# Altium schematic sheet ESP32.SchDoc
size A4
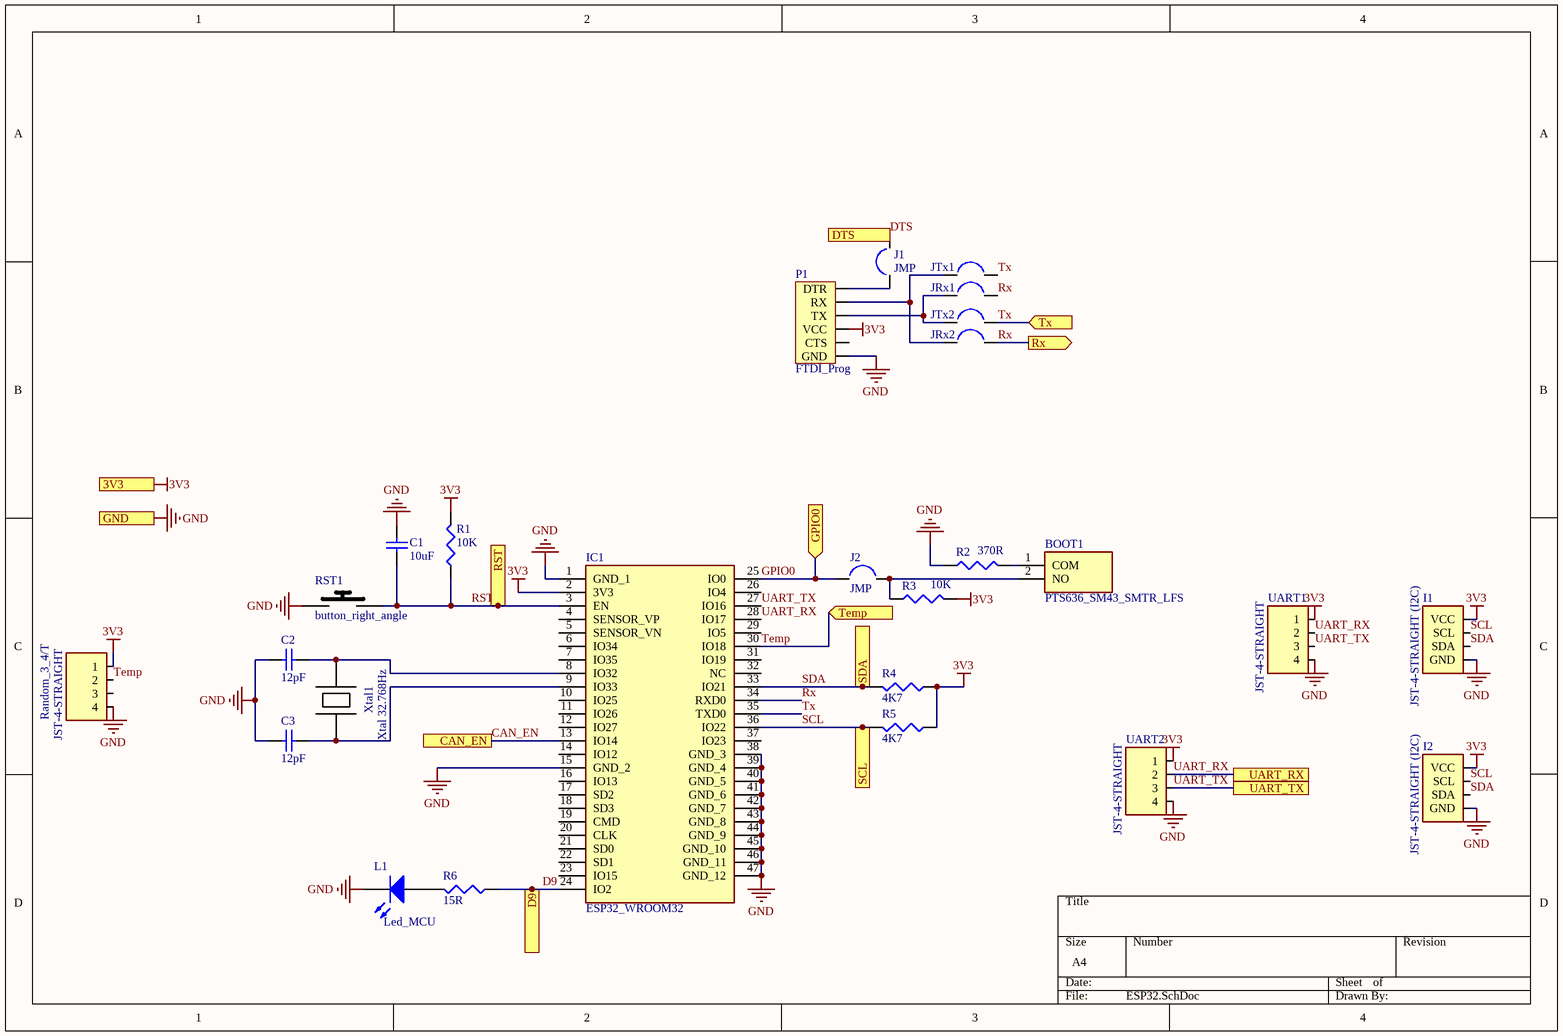
[diagram p0: ESP32.SchDoc]

## Parts
BOOT1  PTS636_SM43_SMTR_LFS  [PTS636SM43SMTRLFS]
C1  10uF  [1608[0603]]
C2  12pF  [1608[0603]]
C3  12pF  [1608[0603]]
I1  JST-4-STRAIGHT (I2C)  [JST-4-STRAIGHT]
I2  JST-4-STRAIGHT (I2C)  [JST-4-STRAIGHT]
IC1  ESP32_WROOM32  [ESP32WROOM32]
J1  JMP  [Jumper]
J2  JMP  [Jumper]
JRx1  JMP  [Jumper]  (value not drawn)
JRx2  JMP  [Jumper]  (value not drawn)
JTx1  JMP  [Jumper]  (value not drawn)
JTx2  JMP  [Jumper]  (value not drawn)
L1  Led_MCU  [LED 0603]
P1  FTDI_Prog  [programer]
R1  10K  [J1-0603]
R2  370R  [J1-0603]
R3  10K  [J1-0603]
R4  4K7  [J1-0603]
R5  4K7  [J1-0603]
R6  15R  [J1-0603]
Random_3_4/T  JST-4-STRAIGHT  [JST-4-STRAIGHT]
RST1  button_right_angle  [1825027-8]
UART1  JST-4-STRAIGHT  [JST-4-STRAIGHT]
UART2  JST-4-STRAIGHT  [JST-4-STRAIGHT]
Xtal1  Xtal 32.768Hz  [LFXTAL050789]

## Ports
3V3 (in), CAN_EN, D9, DTS, GND, GPIO0 (in), RST (in), Rx (out), SCL, SDA, Temp (in), Tx (in), UART_RX, UART_TX

## Nets
3V3: I1.1(VCC) I2.1(VCC) IC1.2(3V3) P1.4(VCC) R1.2 R3.2 R4.1 R5.1 Random_3_4/T.1 UART1.1 UART2.1 ; port 3V3
GND: C1.2 C2.2 C3.2 I1.4(GND) I2.4(GND) IC1.1(GND_1) IC1.15(GND_2) IC1.38(GND_3) IC1.39(GND_4) IC1.40(GND_5) IC1.41(GND_6) IC1.42(GND_7) IC1.43(GND_8) IC1.44(GND_9) IC1.45(GND_10) IC1.46(GND_11) IC1.47(GND_12) L1.2(K) P1.6(GND) R2.1 Random_3_4/T.4 RST1.1 UART1.4 UART2.4 ; port GND
CAN_EN: IC1.13(IO14) ; port CAN_EN
D9: IC1.24(IO2) R6.1 ; port D9
DTS: J1.2 ; port DTS
GPIO0: IC1.25(IO0) J2.1 ; port GPIO0
RST: C1.1 IC1.3(EN) R1.1 RST1.2 ; port RST
Rx: IC1.34(RXD0) JRx1.2 JRx2.2 ; port Rx
SCL: I1.2(SCL) I2.2(SCL) IC1.36(IO22) R5.2 ; port SCL
SDA: I1.3(SDA) I2.3(SDA) IC1.33(IO21) R4.2 ; port SDA
Temp: IC1.30(IO18) Random_3_4/T.2 ; port Temp
Tx: IC1.35(TXD0) JTx1.2 JTx2.2 ; port Tx
UART_RX: IC1.28(IO17) UART1.2 UART2.2 ; port UART_RX
UART_TX: IC1.27(IO16) UART1.3 UART2.3 ; port UART_TX
NetBOOT1_1: BOOT1.1(COM) R2.2
NetBOOT1_2: BOOT1.2(NO) J2.2 R3.1
NetC2_1: C2.1 IC1.8(IO32) Xtal1.2
NetC3_1: C3.1 IC1.9(IO33) Xtal1.1
NetJ1_1: J1.1 P1.1(DTR)
NetJRx1_1: JRx1.1 JTx2.1 P1.3(TX)
NetJRx2_1: JRx2.1 JTx1.1 P1.2(RX)
NetL1_1: L1.1(A) R6.2

Not connected (* = marked no-connect by the designer): IC1 4(SENSOR_VP) 5(SENSOR_VN) 6(IO34) 7(IO35) 10(IO25) 11(IO26) 12(IO27) 14(IO12) 16(IO13) 17(SD2) 18(SD3) 19(CMD) 20(CLK) 21(SD0) 22(SD1) 23(IO15) 26(IO4) 29(IO5) 31(IO19) 32(NC) 37(IO23); P1 5(CTS); Random_3_4/T 3

## Library data of the parts
BOOT1 = PTS636_SM43_SMTR_LFS: Switch; Manufacturer_Name: C & K COMPONENTS; Manufacturer_Part_Number: PTS636 SM43 SMTR LFS; Datasheet Link: https://componentsearchengine.com/Datasheets/1/PTS636 SM43 SMTR LFS.pdf; Height: 4.5mm; Mouser Part Number: 611-PTS636SM43SMTRLF; Mouser Price/Stock: https://www.mouser.co.uk/ProductDetail/CK/PTS636-SM43-SMTR-LFS?qs=vLWxofP3U2xu5raMGkTmHg%3D%3D; Arrow Part Number: PTS636 SM43 SMTR LFS; Arrow Price/Stock: https://www.arrow.com/en/products/pts636-sm43-smtr-lfs/ck
C1-C3 = Cap Semi: Capacitor (Semiconductor SIM Model); Published: 8-Jun-2000; LatestRevisionDate: 29-May-2009; LatestRevisionNote: IPC-7351 Footprint Added.; PackageReference: C1206; Publisher: Altium Limited; PackageDescription: Chip Capacitor
  C1: Value: 10uF
  C2 C3: Value: 12pF
IC1 = ESP32_WROOM32: Integrated Circuit; Manufacturer_Name: Espressif Systems; Manufacturer_Part_Number: ESP32 WROOM32; Datasheet Link: https://www.espressif.com/sites/default/files/documentation/esp32-wroom-32_datasheet_en.pdf; Height: 3.2mm
L1 = LED3: Typical BLUE SiC LED; Published: 8-Jun-2000; LatestRevisionDate: 17-Dec-2003; LatestRevisionNote: PCB Footprint replaced.; DatasheetVersion: 16-Apr-2002; PackageVersion: 16-Apr-2002; PackageReference: 3.5X2.8X1.9; Publisher: Altium Limited; PackageDescription: SM LED; 2 C-Bend Leads; Body 3.5 x 2.8 x 1.9 mm, inc leads (LxWxH typ)
P1 = Programer: FTDI_programer FT232RL USB TO TTL
R1-R6 = Res3: Resistor; Published: 8-Jun-2000; LatestRevisionDate: 29-May-2009; LatestRevisionNote: IPC-7351 Footprint Added.; PackageReference: J1-0603; Publisher: Altium Limited; PackageDescription: Chip Resistor
  R1 R3: Value: 10K
  R2: Value: 370R
  R4 R5: Value: 4K7
  R6: Value: 15R
RST1 = button_right_angle: Switch; Manufacturer_Name: TE Connectivity; Datasheet Link: http://www.te.com/commerce/DocumentDelivery/DDEController?Action=srchrtrv&DocNm=1825027&DocType=Customer+Drawing&DocLang=English; Manufacturer_Part_Number: 1825027-8; Mouser Part Number: 506-1825027-8; Mouser Price/Stock: https://www.mouser.com/Search/Refine.aspx?Keyword=506-1825027-8; RS Part Number: 7182389P; RS Price/Stock: http://uk.rs-online.com/web/p/products/7182389P
Xtal1 = Crystals WE-XTAL 32.7680kHz: 32.7680kHz; Shop: https://www.mouser.sk/ProductDetail/Wurth-Elektronik/830050789?qs=2WXlatMagcG%2Fhb4pC63Fuw%3D%3D